# EAGLE schematic charlieplex-20 (EAGLE 7.7.0)
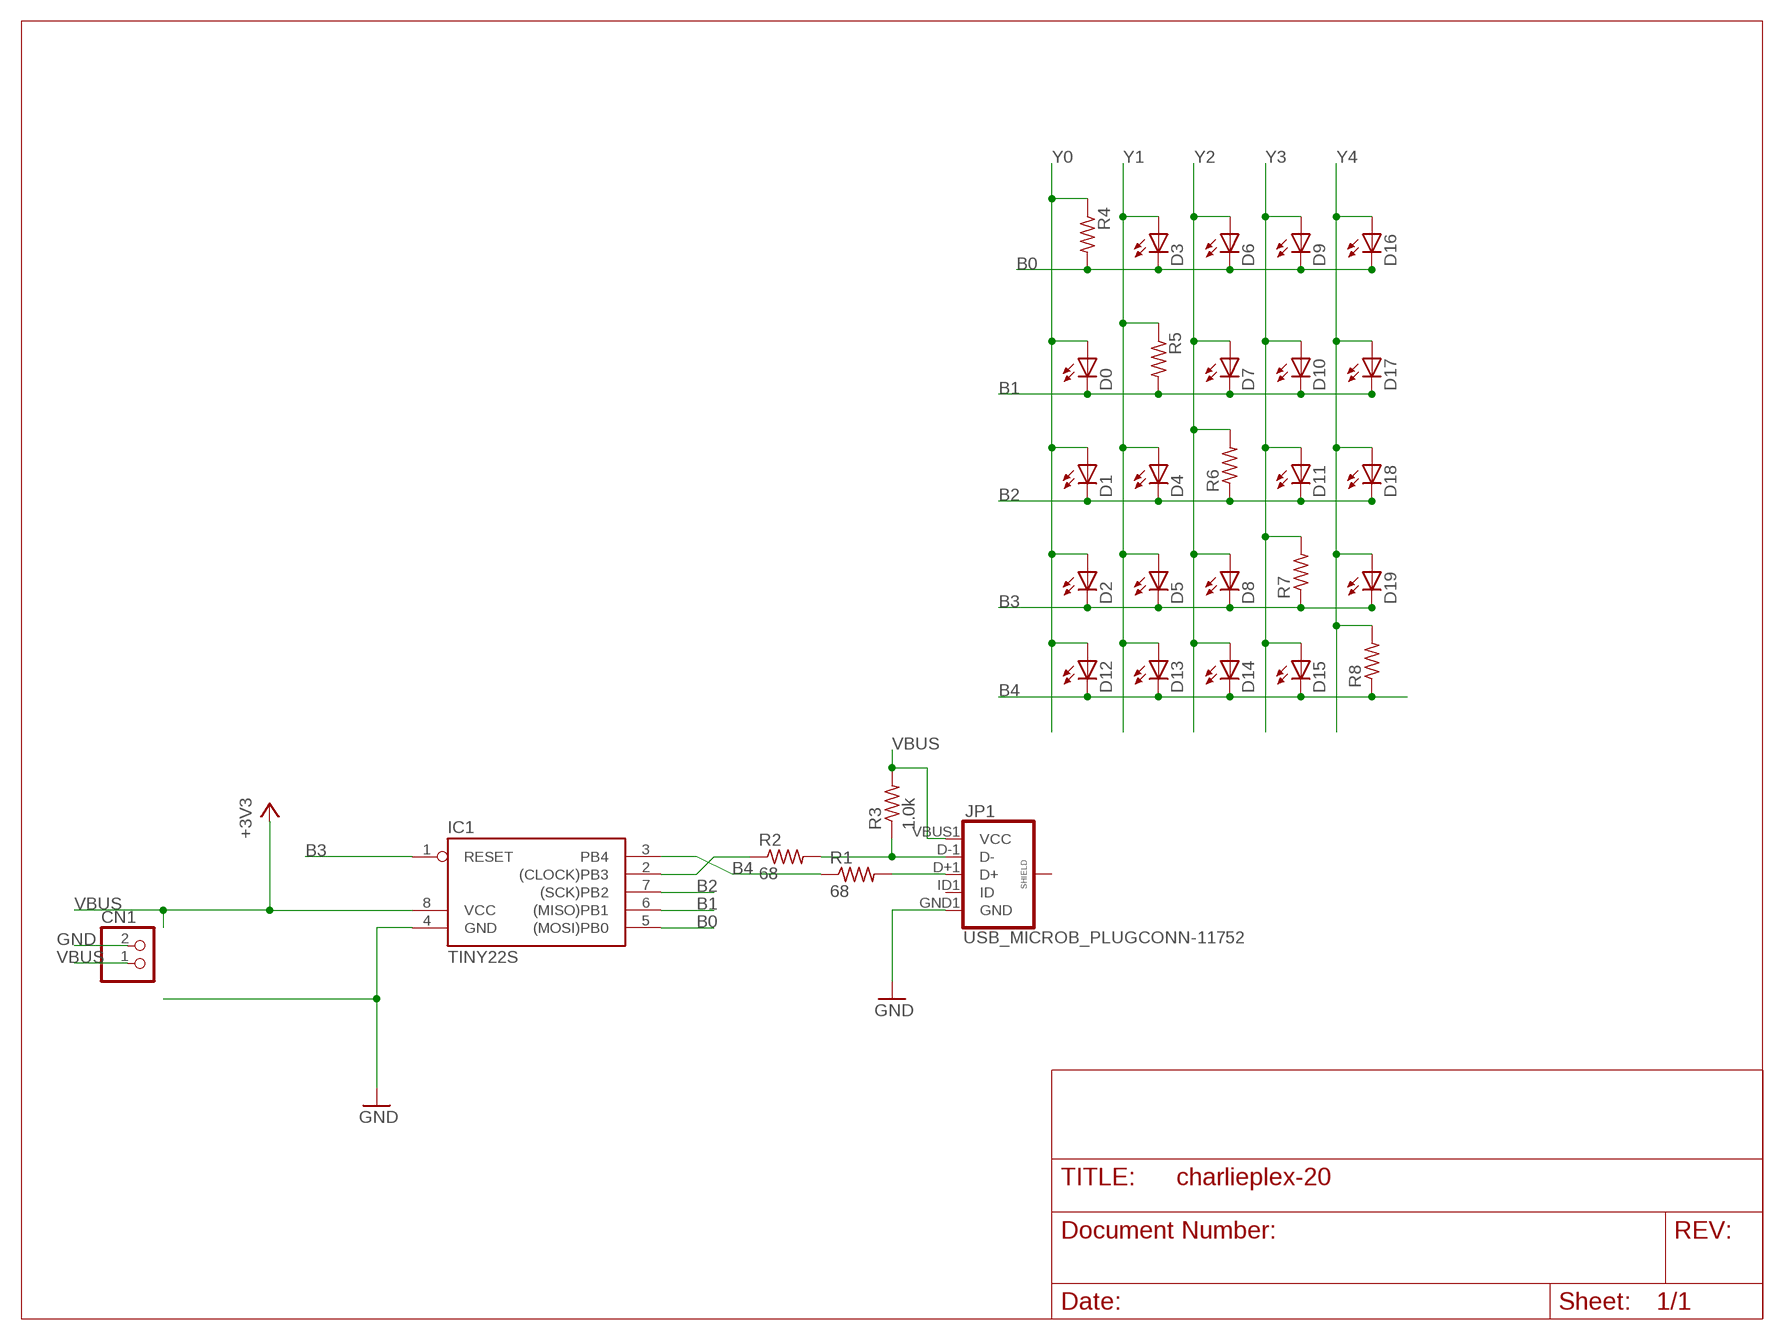
[diagram p0: schematic, sheet 1]

## Parts
CN1  JST_2PIN-THM-RA  [JST-PH-2-THM-RA]
D0  LEDCHIPLED_0805  [CHIPLED_0805]
D1  LEDCHIPLED_0805  [CHIPLED_0805]
D2  LEDCHIPLED_0805  [CHIPLED_0805]
D3  LEDCHIPLED_0805  [CHIPLED_0805]
D4  LEDCHIPLED_0805  [CHIPLED_0805]
D5  LEDCHIPLED_0805  [CHIPLED_0805]
D6  LEDCHIPLED_0805  [CHIPLED_0805]
D7  LEDCHIPLED_0805  [CHIPLED_0805]
D8  LEDCHIPLED_0805  [CHIPLED_0805]
D9  LEDCHIPLED_0805  [CHIPLED_0805]
D10  LEDCHIPLED_0805  [CHIPLED_0805]
D11  LEDCHIPLED_0805  [CHIPLED_0805]
D12  LEDCHIPLED_0805  [CHIPLED_0805]
D13  LEDCHIPLED_0805  [CHIPLED_0805]
D14  LEDCHIPLED_0805  [CHIPLED_0805]
D15  LEDCHIPLED_0805  [CHIPLED_0805]
D16  LEDCHIPLED_0805  [CHIPLED_0805]
D17  LEDCHIPLED_0805  [CHIPLED_0805]
D18  LEDCHIPLED_0805  [CHIPLED_0805]
D19  LEDCHIPLED_0805  [CHIPLED_0805]
IC1  TINY22S  [SOIC8]
JP1  USB_MICROB_PLUGCONN-11752  [USB-B-MICRO-SMD_V03]
R1  68  R-US_R0603  [R0603]
R2  68  R-US_R0603  [R0603]
R3  1.0k  R-US_R0603  [R0603]
R4  R-US_R0603  [R0603]
R5  R-US_R0603  [R0603]
R6  R-US_R0603  [R0603]
R7  R-US_R0603  [R0603]
R8  R-US_R0603  [R0603]

## Nets
B0: D3.C D6.C D9.C D16.C IC1.5((MOSI)PB0) R4.2
B1: D0.C D7.C D10.C D17.C IC1.6((MISO)PB1) R5.2
B2: D1.C D4.C D11.C D18.C IC1.7((SCK)PB2) R6.1
B3: D2.C D5.C D8.C D19.C IC1.1(RESET) R7.1
B4: D12.C D13.C D14.C D15.C IC1.3(PB4) R1.1 R8.1
GND: CN1.2 IC1.4(GND) JP1.GND1(GND)
N$1: JP1.D+1(D+) R1.2
N$2: JP1.D-1(D-) R2.2 R3.1
N$4: IC1.2((CLOCK)PB3) R2.1
VBUS: CN1.1 IC1.8(VCC) JP1.VBUS1(VCC) R3.2 ; supply symbol labelled +3V3
Y0: D0.A D1.A D2.A D12.A R4.1
Y1: D3.A D4.A D5.A D13.A R5.1
Y2: D6.A D7.A D8.A D14.A R6.2
Y3: D9.A D10.A D11.A D15.A R7.2
Y4: D16.A D17.A D18.A D19.A R8.2
Unconnected: JP1.ID1(ID) JP1.SHIELD1(SHIELD) JP1.SHIELD2(SHIELD) JP1.SHIELD3(SHIELD)

## Library data of the parts
CN1 = adafruit:JST_2PIN: JST 2-Pin Connectors of various flavors SMT-RA (S2B-PH-SM4) 4UConnector #17311 SMT (B2B-PH-SM4) THM-RA (S2B-PH) THM (B2B-PH)
D0 D1-D19 = led:LED: LED OSRAM: - CHIPLED LG R971, LG N971, LY N971, LG Q971, LY Q971, LO R971, LY R971 LH N974, LH R974 LS Q976, LO Q976, LY Q976 LO Q996 - Hyper CHIPLED LW Q18S LB Q993, LB Q99A, LB R99A - SideLED LS A670, LO A670, LY A670, LG A670, LP A670 LB A673, LV A673, LT A673, LW A673 LH A674 LY A675 LS A676, LA A676, LO A676, LY A676, LW A676 LS A679, LY A679, LG A679 - Hyper Micro SIDELED® LS Y876, LA Y876, LO Y876, LY Y876 LT Y87S - SmartLED LW L88C, LW L88S LB L89C, LB L89S, LG L890 LS L89K, LO L89K, LY L89K LS L896, LA L896, LO L896, LY L896 - TOPLED LS T670, LO T670, LY T670, LG T670, LP T670 LSG T670, LSP T670, LSY T670, LOP T670, LYG T670 LG T671, LOG T671, LSG T671 LB T673, LV T673, LT T673, LW T673 LH T674 LS T676, LA T676, LO T676, LY T676, LB T676, LH T676, LSB T676, LW T676 LB T67C, LV T67C, LT T67C, LS T67K, LO T67K, LY T67K, LW E67C LS E67B, LA E67B, LO E67B, LY E67B, LB E67C, LV E67C, LT E67C LW T67C LS T679, LY T679, LG T679 LS T770, LO T770, LY T770, LG T770, LP T770 LB T773, LV T773, LT T773, LW T773 LH T774 LS E675, LA E675, LY E675, LS T675 LS T776, LA T776, LO T776, LY T776, LB T776 LHGB T686 LT T68C, LB T68C - Hyper Mini TOPLED® LB M676 - Mini TOPLED Santana® LG M470 LS M47K, LO M47K, LY M47K Source: http://www.osram.convergy.de LUXEON: - LUMILED® LXK2-PW12-R00, LXK2-PW12-S00, LXK2-PW14-U00, LXK2-PW14-V00 LXK2-PM12-R00, LXK2-PM12-S00, LXK2-PM14-U00 LXK2-PE12-Q00, LXK2-PE12-R00, LXK2-PE12-S00, LXK2-PE14-T00, LXK2-PE14-U00 LXK2-PB12-K00, LXK2-PB12-L00, LXK2-PB12-M00, LXK2-PB14-N00, LXK2-PB14-P00, LXK2-PB14-Q00 LXK2-PR12-L00, LXK2-PR12-M00, LXK2-PR14-Q00, LXK2-PR14-R00 LXK2-PD12-Q00, LXK2-PD12-R00, LXK2-PD12-S00 LXK2-PH12-R00, LXK2-PH12-S00 LXK2-PL12-P00, LXK2-PL12-Q00, LXK2-PL12-R00 Source: www.luxeon.com KINGBRIGHT: KA-3528ASYC Source: www.kingbright.com
IC1 = atmel:TINY22: MICROCONTROLLER 1K ROM 128 bytes RAM 128 bytes EEPROM; OC_FARNELL: unknown; OC_NEWARK: unknown
JP1 = SparkFun-Connectors:USB_MICROB_PLUG: USB Micro-B connectors Some male, some female. Watch your step!; PROD_ID: CONN-11752
R1-R8 = resistor:R-US_: RESISTOR, American symbol

## Net classes
0 default: width 0.406 mm